# EAGLE design ESP8266Shield (EAGLE 7.1.0)
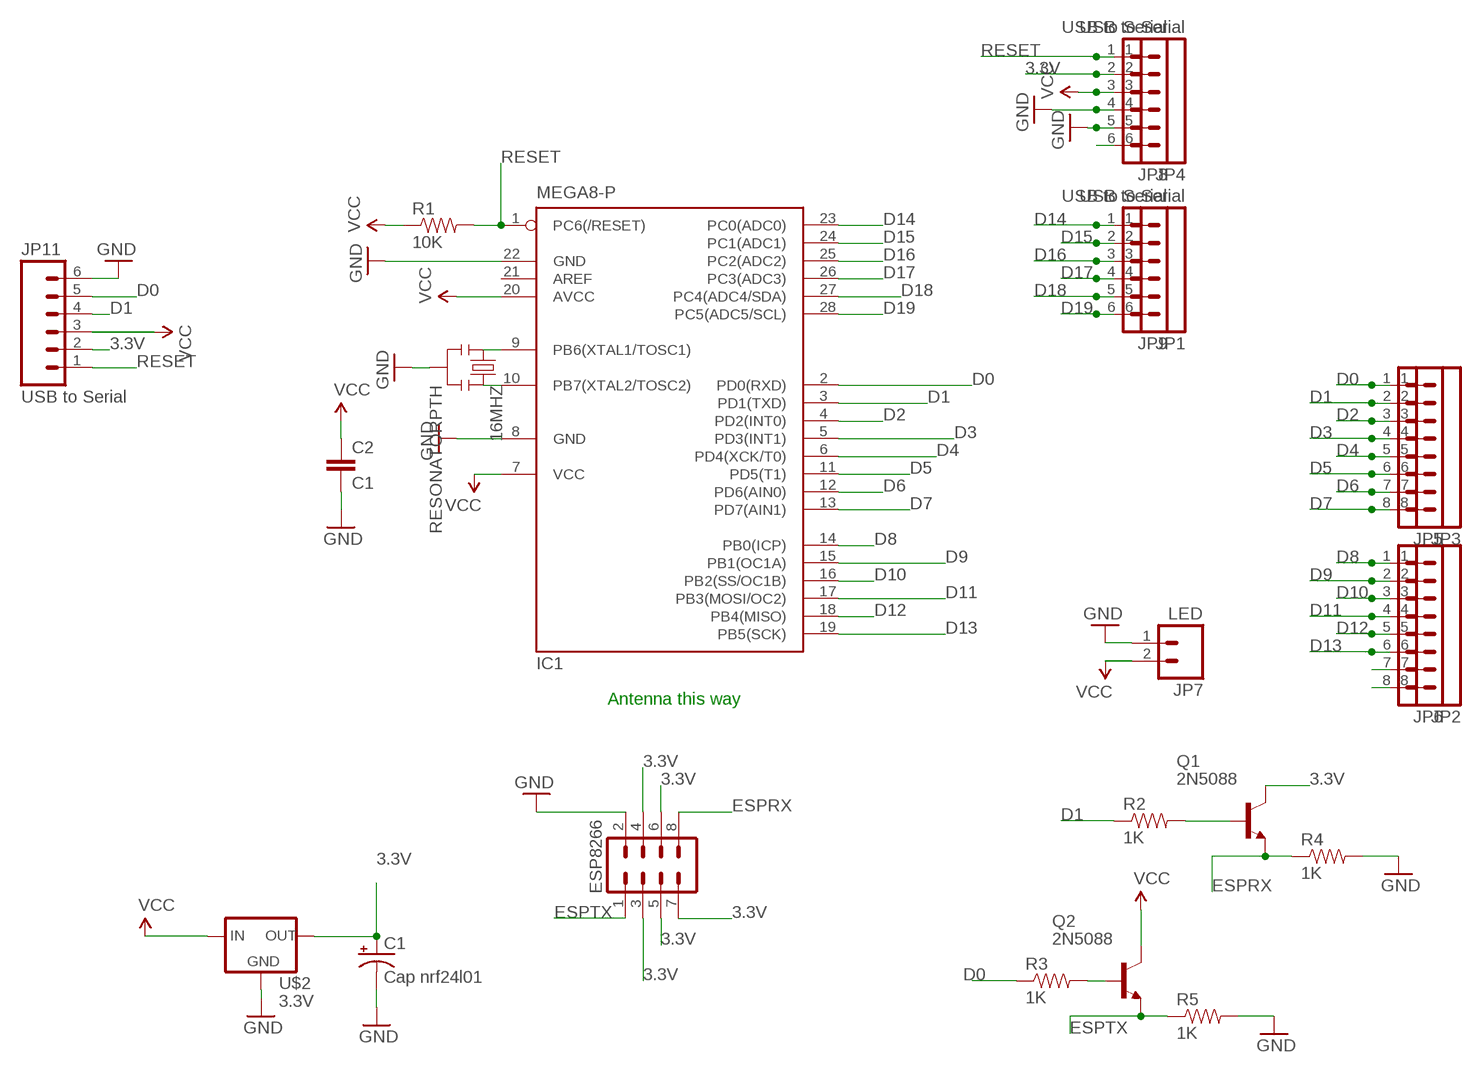
[diagram p0: schematic, sheet 1]

## Parts
16MHZ  RESONATORPTH  [RESONATOR-PTH]
C1  Cap nrf24l01  CAP_POLPTH2  [CPOL-RADIAL-10UF-25V]
C2  C1  CAPPTH  [CAP-PTH-SMALL]
ESP8266  M04X2  [2X4]
IC1  MEGA8-P  [DIL28-3]
JP1  USB to Serial  M06SIP  [1X06]
JP2  M08  [1X08]
JP3  M08  [1X08]
JP4  USB to Serial  M06SIP  [1X06]
JP5  M08  [1X08]
JP6  M08  [1X08]
JP7  LED  M02PTH  [1X02]
JP8  USB to Serial  M06SIP  [1X06]
JP9  USB to Serial  M06SIP  [1X06]
JP11  USB to Serial  M06SIP  [1X06]
Q1  2N5088  [TO92]
Q2  2N5088  [TO92]
R1  10K  RESISTORPTH1  [AXIAL-0.3]
R2  1K  RESISTORPTH1  [AXIAL-0.3]
R3  1K  RESISTORPTH1  [AXIAL-0.3]
R4  1K  RESISTORPTH1  [AXIAL-0.3]
R5  1K  RESISTORPTH1  [AXIAL-0.3]
U$2  3.3V  V_REG_LD1117VXX  [78XXL]

## Nets
3.3V: C1.1(+) ESP8266.3 ESP8266.4 ESP8266.5 ESP8266.6 ESP8266.7 JP4.2 JP8.2 JP11.2 Q1.1(C) U$2.GND(OUT)
D0: IC1.2(PD0(RXD)) JP3.1 JP5.1 JP11.5 R3.P$1
D1: IC1.3(PD1(TXD)) JP3.2 JP5.2 JP11.4 R2.P$1
D2: IC1.4(PD2(INT0)) JP3.3 JP5.3
D3: IC1.5(PD3(INT1)) JP3.4 JP5.4
D4: IC1.6(PD4(XCK/T0)) JP3.5 JP5.5
D5: IC1.11(PD5(T1)) JP3.6 JP5.6
D6: IC1.12(PD6(AIN0)) JP3.7 JP5.7
D7: IC1.13(PD7(AIN1)) JP3.8 JP5.8
D8: IC1.14(PB0(ICP)) JP2.1 JP6.1
D9: IC1.15(PB1(OC1A)) JP2.2 JP6.2
D10: IC1.16(PB2(SS/OC1B)) JP2.3 JP6.3
D11: IC1.17(PB3(MOSI/OC2)) JP2.4 JP6.4
D12: IC1.18(PB4(MISO)) JP2.5 JP6.5
D13: IC1.19(PB5(SCK)) JP2.6 JP6.6
D14: IC1.23(PC0(ADC0)) JP1.1 JP9.1
D15: IC1.24(PC1(ADC1)) JP1.2 JP9.2
D16: IC1.25(PC2(ADC2)) JP1.3 JP9.3
D17: IC1.26(PC3(ADC3)) JP1.4 JP9.4
D18: IC1.27(PC4(ADC4/SDA)) JP1.5 JP9.5
D19: IC1.28(PC5(ADC5/SCL)) JP1.6 JP9.6
ESPRX: ESP8266.8 Q1.3(E) R4.P$1
ESPTX: ESP8266.1 Q2.3(E) R5.P$1
GND: 16MHZ.2 C1.2(-) C2.2 ESP8266.2 IC1.8(GND) IC1.22(GND) JP4.4 JP4.5 JP7.1 JP8.4 JP8.5 JP11.6 R4.P$2 R5.P$2 U$2.IN(GND)
N$1: 16MHZ.3 IC1.10(PB7(XTAL2/TOSC2))
N$2: 16MHZ.1 IC1.9(PB6(XTAL1/TOSC1))
N$3: Q1.2(B) R2.P$2
N$4: Q2.2(B) R3.P$2
N$5: JP2.7 JP6.7
N$6: JP2.8 JP6.8
N$7: JP4.6 JP8.6
RESET: IC1.1(PC6(/RESET)) JP4.1 JP8.1 JP11.1 R1.P$2
VCC: C2.1 IC1.7(VCC) IC1.20(AVCC) JP4.3 JP7.2 JP8.3 JP11.3 Q2.1(C) R1.P$1 U$2.OUT(IN)
Unconnected: IC1.21(AREF)

## Notes on the sheet
- Antenna this way

## Library data of the parts
16MHZ = SparkFun:RESONATOR: Resonator Small SMD resonator. This is the itty bitty 10/20MHz resonators with built in caps. CSTCE10M0G55 and CSTCE20M0V53. Footprint has been reviewed closely but hasn't been tested yet.
C1 = SparkFun:CAP_POL: Capacitor Polarized These are standard SMD and PTH capacitors. Normally 10uF, 47uF, and 100uF in electrolytic and tantalum varieties. Always verify the external diameter of the through hole cap, it varies with capacity, voltage, and manufacturer. The EIA devices should be standard.
C2 = SparkFun:CAP: Capacitor Standard 0603 ceramic capacitor, and 0.1" leaded capacitor.
ESP8266 = SparkFun:M04X2
IC1 = atmel:MEGA8-P: MICROCONTROLLER 8 Kbytes FLASH, 1 kbytes SRAM, 512 bytes EEPROM, USART, 4-channel 10 bit ADC, 2-channel 8 bit ADC Pin compatible with Atmega48, ATMega88, ATMega168 Source: avr.lbr; OC_FARNELL: unknown; OC_NEWARK: unknown
JP1 JP4 JP8 JP9 JP11 = SparkFun:M06: Header 6 Standard 6-pin 0.1" header. Use with straight break away headers (SKU : PRT-00116), right angle break away headers (PRT-00553), swiss pins (PRT-00743), machine pins (PRT-00117), and female headers (PRT-00115). Molex polarized connector foot print use with SKU : PRT-08094 with associated crimp pins and housings. NOTES ON THE VARIANTS LOCK and LOCK_LONGPADS... This footprint was designed to help hold the alignment of a through-hole component (i.e. 6-pin header) while soldering it into place. You may notice that each hole has been shifted either up or down by 0.005 of an inch from it's more standard position (which is a perfectly straight line). This slight alteration caused the pins (the squares in the middle) to touch the edges of the holes. Because they are alternating, it causes a "brace" to hold the component in place. 0.005 has proven to be the perfect amount of "off-center" position when using our standard breakaway headers. Although looks a little odd when you look at the bare footprint, once you have a header in there, the alteration is very hard to notice. Also, if you push a header all the way into place, it is covered up entirely on the bottom side. This idea of altering the position of holes to aid alignment will be further integrated into the Sparkfun Library for other footprints. It can help hold any component with 3 or more connection pins.
JP2 JP3 JP5 JP6 = SparkFun:M08: Header 8 Standard 8-pin 0.1" header. Use with straight break away headers (SKU : PRT-00116), right angle break away headers (PRT-00553), swiss pins (PRT-00743), machine pins (PRT-00117), and female headers (PRT-00115).
JP7 = SparkFun:M02: Header 2 Standard 2-pin 0.1" header. Use with straight break away headers (SKU : PRT-00116), right angle break away headers (PRT-00553), swiss pins (PRT-00743), machine pins (PRT-00117), and female headers (PRT-00115). Molex polarized connector foot print use with SKU : PRT-08233 with associated crimp pins and housings.
Q1 Q2 = transistor-npn:2N5088: NPN Transistor
R1-R5 = SparkFun:RESISTOR: Resistor Basic schematic elements and footprints for 0603, 1206, and PTH 1/10th watt (small) resistors.
U$2 = SparkFun:V_REG_LD1117VXX: LD1117VXX voltage regulator. We carry the 3.3V version (COM-00526) in TO-220 package.

## Board
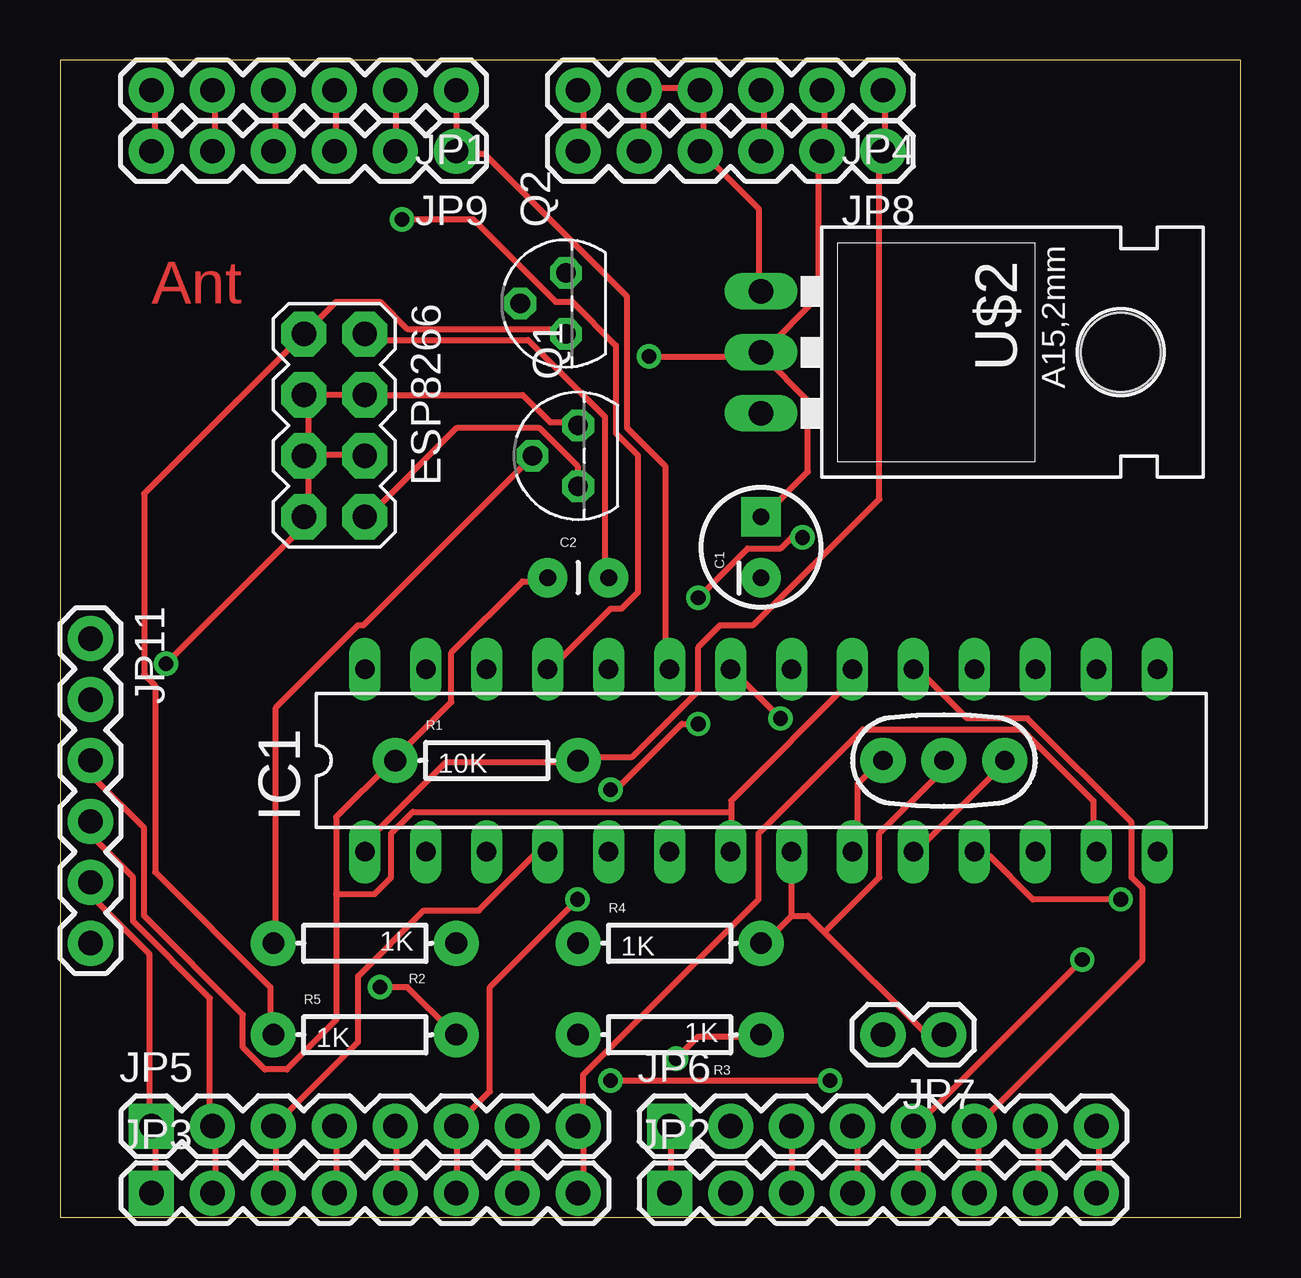
[diagram p1: board, top side]
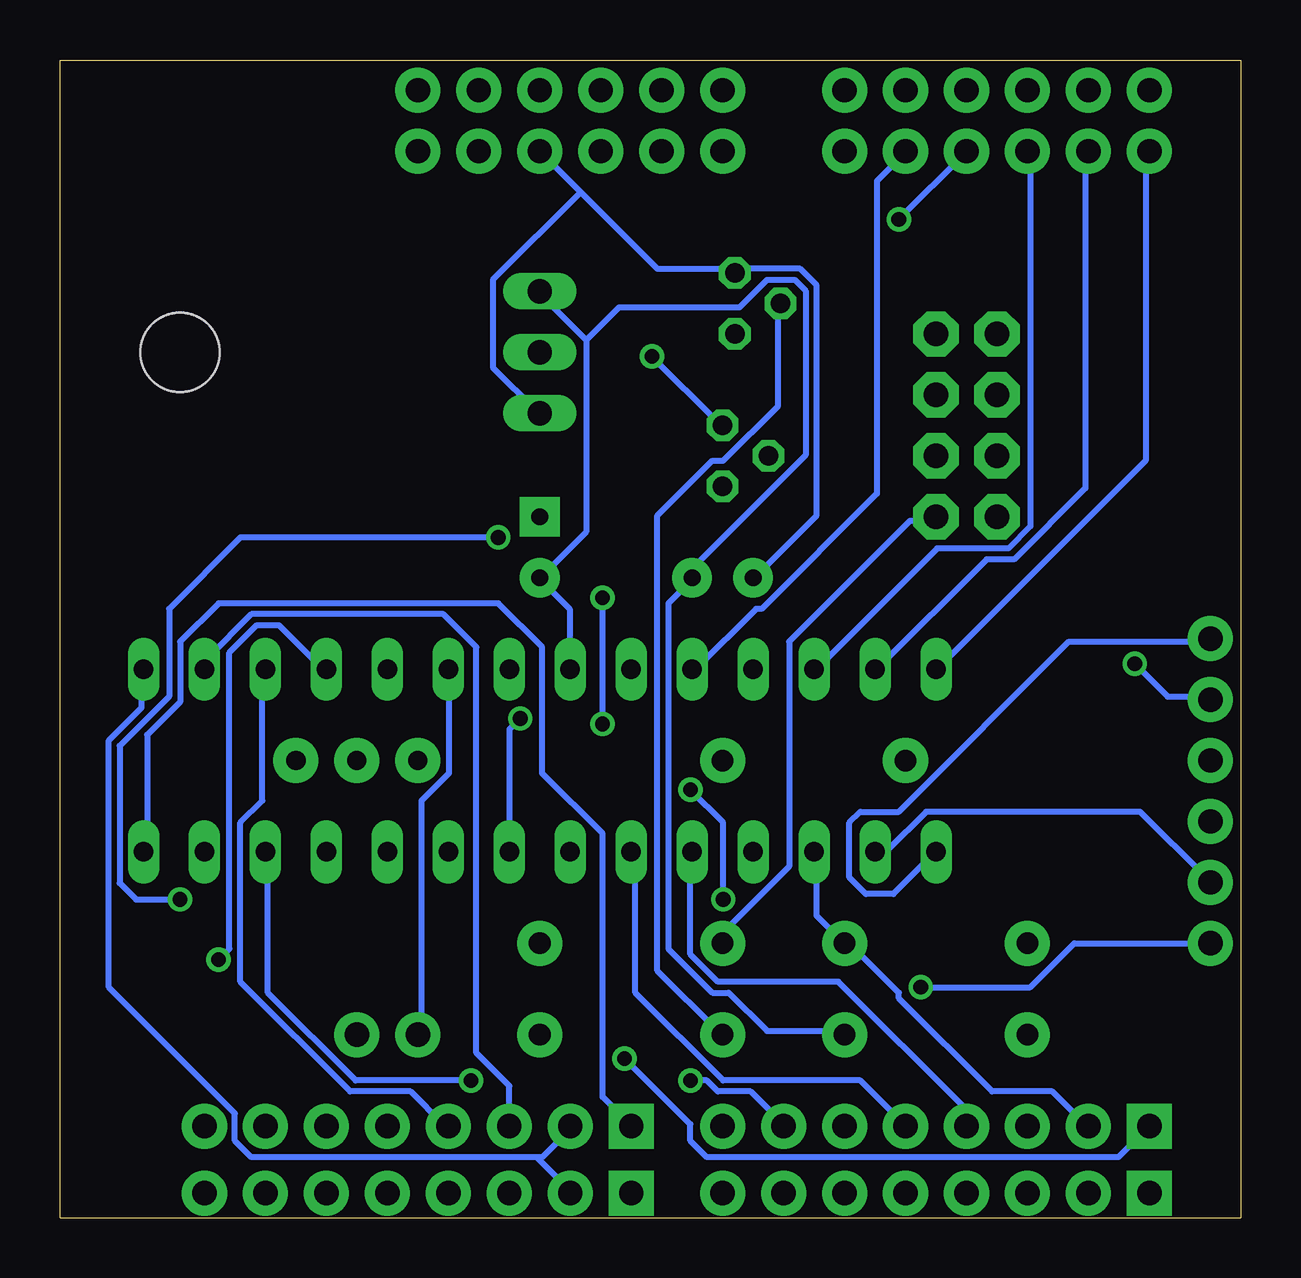
[diagram p2: board, bottom side, seen from below]

Size 49.2 x 48.26 mm. Coordinates in mm from the lower left corner, seen from the top.
Outline: 49.2,0 49.2,48.26 0,48.26 0,0 49.2,0
Copper layers (1*16): Top 0.035mm / dielectric 1.5mm / Bottom 0.035mm
Design rules "default": minimum track width 10mil, minimum drill 24mil, track to track 8mil, track to pad 8mil, pad to pad 8mil, via to via 8mil, smd to smd 8mil, copper to edge 40mil, drill to drill 8mil, minimum pad ring 10mil, minimum via ring 8mil, stop-mask expansion 4mil, vias tented up to drill 0mil, thermal gap 10mil

### Footprints (pad centres in the part's own frame; a part is rotated, then mirrored left to right if it is on the bottom)
RESONATOR-PTH = drill 0.8 pad 1.88: 1 -2.54,0; 2 0,0; 3 2.54,0
CPOL-RADIAL-10UF-25V = drill 0.7 pad 1.651 square: 1 1.27,0 | drill 0.7 pad 1.651: 2 -1.27,0
CAP-PTH-SMALL = drill 0.7 pad 1.651: 1 0,0; 2 2.54,0
2X4 = drill 1.016 pad 1.88 octagon: 1 -3.81,-1.27; 2 -3.81,1.27; 3 -1.27,-1.27; 4 -1.27,1.27; 5 1.27,-1.27; 6 1.27,1.27; 7 3.81,-1.27; 8 3.81,1.27
DIL28-3 = drill 0.813 long: 1 -16.51,-3.81; 2 -13.97,-3.81; 3 -11.43,-3.81; 4 -8.89,-3.81; 5 -6.35,-3.81; 6 -3.81,-3.81; 7 -1.27,-3.81; 8 1.27,-3.81; 9 3.81,-3.81; 10 6.35,-3.81; 11 8.89,-3.81; 12 11.43,-3.81; 13 13.97,-3.81; 14 16.51,-3.81; 15 16.51,3.81; 16 13.97,3.81; 17 11.43,3.81; 18 8.89,3.81; 19 6.35,3.81; 20 3.81,3.81; 21 1.27,3.81; 22 -1.27,3.81; 23 -3.81,3.81; 24 -6.35,3.81; 25 -8.89,3.81; 26 -11.43,3.81; 27 -13.97,3.81; 28 -16.51,3.81
1X06 = drill 1.016 pad 1.88: 1 0,0; 2 2.54,0; 3 5.08,0; 4 7.62,0; 5 10.16,0; 6 12.7,0
1X08 = drill 1.016 pad 1.88 square: 1 0,0 | drill 1.016 pad 1.88: 2 2.54,0; 3 5.08,0; 4 7.62,0; 5 10.16,0; 6 12.7,0; 7 15.24,0; 8 17.78,0
1X02 = drill 1.016 pad 1.88: 1 0,0; 2 2.54,0
TO92 = drill 0.813 octagon: 1 1.27,0; 2 0,1.905; 3 -1.27,0
AXIAL-0.3 = drill 0.9 pad 1.88: P$1 -3.81,0; P$2 3.81,0
78XXL = drill 1.016 long: GND 0,-3.81; IN -2.54,-3.81; OUT 2.54,-3.81 | hole 3.302: 0,11.176

### Placement (x,y rotation side)
16MHZ  36.83,19.06 0 top
C1  29.21,27.95 90 top
C2  20.32,26.68 0 top
ESP8266  11.43,33.03 270 top
IC1  29.21,19.06 0 top
JP1  16.51,47 180 top
JP2  25.4,1.03 0 top
JP3  3.81,1.03 0 top
JP4  34.29,47 180 top
JP5  3.81,3.82 0 top
JP6  25.4,3.82 0 top
JP7  36.83,7.63 180 top
JP8  34.29,44.46 180 top
JP9  16.51,44.46 180 top
JP11  1.27,24.14 270 top
Q1  21.59,31.76 90 top
Q2  21.08,38.11 90 top
R1  17.78,19.06 0 top
R2  12.7,11.44 180 top
R3  25.4,7.63 180 top
R4  25.4,11.44 0 top
R5  12.7,7.63 0 top
U$2  33.02,36.08 270 top

### Tracks (layer width: path | path; a pad name or v marks a point on that pad's centre or on a via)
3.3V  (via drill 0.61)
  Top 0.254: JP4.2 31.85,46.87 31.85,44.59 JP8.2 31.62,44.36 31.62,38.41 29.34,36.13 U$2.GND | U$2.GND 29.34,35.9 31.17,34.07 31.17,31.1 29.34,29.27 C1.1 | Q1.1 21.56,33.16 20.42,33.16 19.28,34.3 ESP8266.4 10.36,34.3 | 10.36,31.79 12.65,31.79 ESP8266.6 | v4.42,23.1 10.36,29.04 ESP8266.7 10.36,29.27 10.36,31.56 ESP8266.5 10.36,31.79 | 10.36,31.79 10.36,34.3 | 10.36,34.3 ESP8266.3 | v24.54,35.9 29.11,35.9 U$2.GND
  Bottom 0.254: v4.42,23.1 3.05,21.73 1.45,21.73 JP11.2 | v24.54,35.9 21.79,33.16 Q1.1
D0  (via drill 0.61)
  Top 0.254: JP3.1 3.96,1.15 3.96,3.67 JP5.1 3.73,3.9 3.73,10.98 1.45,13.27 1.45,13.96 JP11.5 | v25.68,6.64 26.59,7.55 29.11,7.55 R3.P$1
  Bottom 0.254: IC1.2 15.16,15.33 14.71,15.33 13.11,16.93 4.19,16.93 1.45,14.18 JP11.5 | v25.68,6.64 22.94,3.9 22.94,3.21 22.25,2.52 5.1,2.52 JP5.1
D1
  Top 0.254: JP3.2 6.48,1.15 6.48,3.67 JP5.2 6.25,3.9 6.25,9.15 3.05,12.35 3.05,14.18 1.45,15.78 1.45,16.47 JP11.4
  Bottom 0.254: IC1.3 17.68,15.1 17.68,12.58 16.53,11.44 R2.P$1 16.31,11.44 14.25,9.38 14.25,9.15 10.36,5.27 7.85,5.27 6.48,3.9 JP5.2
D2
  Top 0.254: IC1.4 20.19,15.1 19.74,15.1 17.45,12.81 15.16,12.81 12.42,10.07 12.42,7.33 8.99,3.9 JP5.3 8.99,3.67 8.99,1.15 JP3.3
D3
  Top 0.254: JP3.4 11.51,1.15 11.51,3.67 JP5.4
  Bottom 0.254: IC1.5 22.94,15.1 22.94,10.98 21.79,9.84 16.76,9.84 11.51,4.58 11.51,3.9 JP5.4
D4
  Top 0.254: JP3.5 14.02,1.15 14.02,3.67 JP5.5
  Bottom 0.254: IC1.6 25.22,15.1 25.22,9.38 21.56,5.72 15.85,5.72 14.02,3.9 JP5.5
D5  (via drill 0.61)
  Top 0.254: v44.2,13.27 40.54,13.27 38.71,15.1 38.25,15.1 IC1.11 | v30.94,28.36 30.48,28.36 30.02,27.9 28.65,27.9 v26.59,25.84 | v26.59,20.58 25.91,20.58 23.16,17.84 v22.94,17.84 | v21.56,13.27 17.91,9.61 17.91,5.27 16.53,3.9 JP5.6 16.53,3.67 16.53,1.15 JP3.6
  Bottom 0.254: v44.2,13.27 46.02,13.27 46.71,13.96 46.71,19.67 44.65,21.73 44.65,25.39 41.68,28.36 v30.94,28.36 | v26.59,20.58 v26.59,25.84 | v22.94,17.84 21.56,16.47 v21.56,13.27
D6  (via drill 0.61)
  Top 0.254: v22.94,5.72 v32.08,5.72 | JP5.7 JP3.7
  Bottom 0.254: v32.08,5.72 36.88,5.72 40.54,9.38 40.54,15.1 IC1.12 | v22.94,5.72 22.25,5.72 21.79,5.27 20.42,5.27 19.05,3.9 JP5.7
D7
  Top 0.254: IC1.13 43.05,15.33 43.05,17.38 40.08,20.36 33.45,20.36 29.11,16.01 29.11,13.27 21.79,5.95 21.79,3.9 JP5.8 21.79,3.67 21.79,1.15 JP3.8
D8
  Top 0.254: JP2.1 25.45,1.15 25.45,3.67 JP6.1
  Bottom 0.254: IC1.14 45.57,15.33 45.57,20.13 44.2,21.5 44.2,24.01 42.6,25.61 30.94,25.61 29.11,23.78 29.11,18.53 26.59,16.01 26.59,5.04 25.45,3.9 JP6.1
D9
  Bottom 0.254: 29.34,2.52 29.11,2.52 27.96,3.67 JP6.2 | 29.34,2.52 41.22,2.52 41.91,3.21 41.91,4.35 47.17,9.61 47.17,19.9 45.8,21.27 45.8,22.87 IC1.15 | 29.34,2.52 27.96,1.15 JP2.2
D10
  Top 0.254: JP6.3 JP2.3
  Bottom 0.254: JP6.3 30.48,5.5 31.85,6.87 31.85,23.78 33.22,25.16 41.22,25.16 43.05,23.33 43.05,22.87 IC1.16
D11
  Top 0.254: JP2.4 33.22,1.15 33.22,3.67 JP6.4
  Bottom 0.254: IC1.17 40.77,22.87 40.77,17.38 41.68,16.47 41.68,9.84 37.11,5.27 34.59,5.27 33.22,3.9 JP6.4
D12  (via drill 0.61)
  Top 0.254: v42.6,10.75 35.74,3.9 JP6.5 35.74,3.67 35.74,1.15 JP2.5
  Bottom 0.254: v42.6,10.75 42.14,11.21 42.14,23.56 41,24.7 40.08,24.7 38.25,22.87 IC1.18
D13
  Top 0.254: IC1.19 35.74,22.87 37.8,20.81 40.31,20.81 44.65,16.47 44.65,14.18 45.11,13.73 45.11,10.75 38.25,3.9 JP6.6 38.25,3.67 38.25,1.15 JP2.6
D14
  Top 0.254: IC1.23 25.22,22.87 25.22,31.33 23.62,32.93 23.62,38.41 17.68,44.36 16.53,44.36 JP9.1 16.53,44.59 16.53,46.87 JP1.1
D15
  Top 0.254: JP1.2 14.02,46.87 14.02,44.59 JP9.2
  Bottom 0.254: IC1.24 22.71,22.87 20.19,25.39 19.96,25.39 15.16,30.19 15.16,43.21 14.02,44.36 JP9.2
D16  (via drill 0.61)
  Top 0.254: v14.25,41.61 17.22,41.61 20.65,38.19 21.34,38.19 23.16,36.36 23.16,32.7 24.08,31.79 24.08,26.07 23.39,25.39 22.94,25.39 20.42,22.87 IC1.25 | JP1.3 11.51,46.87 11.51,44.59 JP9.3
  Bottom 0.254: v14.25,41.61 11.51,44.36 JP9.3
D17
  Top 0.254: JP1.4 8.99,46.87 8.99,44.59 JP9.4
  Bottom 0.254: IC1.26 17.68,22.87 12.65,27.9 9.68,27.9 8.76,28.81 8.76,44.36 JP9.4
D18
  Top 0.254: JP1.5 6.48,46.87 6.48,44.59 JP9.5
  Bottom 0.254: IC1.27 15.16,22.87 10.59,27.44 9.45,27.44 6.48,30.41 6.48,44.36 JP9.5
D19
  Top 0.254: JP1.6 3.96,46.87 3.96,44.59 JP9.6
  Bottom 0.254: IC1.28 12.65,22.87 3.96,31.56 3.96,44.36 JP9.6
ESPRX
  Top 0.254: Q1.3 21.56,30.64 21.56,31.33 19.96,32.93 16.53,32.93 12.88,29.27 ESP8266.8
  Bottom 0.254: R4.P$1 21.56,11.44 21.56,11.9 18.82,14.64 18.82,24.01 13.79,29.04 12.88,29.04 ESP8266.8
ESPTX
  Top 0.254: Q2.3 20.88,37.04 14.48,37.04 13.34,38.19 11.51,38.19 ESP8266.1 3.5,30.19 3.5,22.64 3.96,22.18 3.96,14.41 8.76,9.61 8.76,7.78 R5.P$1
GND  (via drill 0.61)
  Top 0.254: C2.2 22.71,26.76 22.71,33.39 19.51,36.59 13.11,36.59 12.88,36.81 ESP8266.2 | v13.34,9.61 14.48,9.61 16.31,7.78 R5.P$2 | 30.48,12.58 IC1.8 | 30.48,12.58 29.34,11.44 R4.P$2 | 31.85,11.9 31.17,12.58 30.48,12.58 | 31.85,11.9 35.97,7.78 36.65,7.78 JP7.1 | 31.85,11.9 34.14,14.18 34.14,16.01 36.65,18.53 36.65,18.98 16MHZ.2 | JP8.5 24.31,44.59 24.31,46.87 JP4.5 24.31,47.1 26.59,47.1 JP4.4 26.82,46.87 26.82,44.59 JP8.4 26.82,44.36 29.11,42.07 29.11,38.64 U$2.IN | v30.02,20.81 27.96,22.87 IC1.22
  Bottom 0.254: R5.P$2 16.53,7.78 19.74,7.78 21.34,9.38 22.02,9.38 23.85,11.21 23.85,25.61 22.94,26.53 C2.2 22.71,26.76 22.71,27.21 18.14,31.79 18.14,38.64 18.59,39.1 19.74,39.1 20.88,37.96 25.91,37.96 27.28,36.59 | JP11.6 6.93,11.44 8.76,9.61 v13.34,9.61 | IC1.22 27.96,22.87 27.96,25.39 29.11,26.53 C1.2 29.11,26.76 27.28,28.59 27.28,36.59 | 27.28,36.59 29.11,38.41 U$2.IN | IC1.8 30.48,20.36 v30.02,20.81
N$1
  Top 0.254: IC1.10 35.74,15.33 39.39,18.98 16MHZ.3
N$2
  Top 0.254: IC1.9 33.22,15.33 33.22,18.07 34.14,18.98 16MHZ.1
N$3
  Top 0.254: Q1.2 19.51,31.56 12.65,24.7 12.42,24.7 8.99,21.27 8.99,11.44 R2.P$2
N$4
  Bottom 0.254: Q2.2 19.28,37.96 19.28,33.84 21.56,31.56 22.02,31.56 24.31,29.27 24.31,10.3 21.79,7.78 R3.P$2
N$5
  Top 0.254: JP2.7 40.77,1.15 40.77,3.67 JP6.7
N$6
  Top 0.254: JP2.8 43.28,1.15 43.28,3.67 JP6.8
N$7
  Top 0.254: JP8.6 21.79,44.59 21.79,46.87 JP4.6
RESET
  Top 0.254: JP4.1 34.37,46.87 34.37,44.59 JP8.1 34.14,44.36 34.14,29.96 28.88,24.7 27.51,24.7 26.59,23.78 26.59,21.96 23.85,19.21 21.79,19.21 R1.P$2 21.56,18.98 16.08,18.98 12.88,15.78 12.88,15.33 IC1.1
  Bottom 0.254: JP11.1 1.45,24.01 7.16,24.01 14.25,16.93 15.85,16.93 16.31,16.47 16.31,14.18 15.62,13.5 14.48,13.5 12.88,15.1 IC1.1
VCC
  Top 0.254: JP4.3 29.34,46.87 29.34,44.59 JP8.3 | 27.96,16.93 27.96,17.38 32.99,22.41 32.99,22.87 IC1.20 | 27.96,16.93 27.96,15.33 IC1.7 | C2.1 20.19,26.53 19.28,26.53 16.31,23.56 16.31,21.5 14.02,19.21 R1.P$1 13.79,18.98 11.51,16.7 11.51,13.5 | 11.51,13.5 11.51,8.24 9.45,6.18 8.53,6.18 7.62,7.1 7.62,8.47 3.5,12.58 3.5,16.24 1.45,18.3 1.45,18.98 JP11.3 | 27.96,16.93 14.71,16.93 13.79,16.01 13.79,14.18 13.11,13.5 11.51,13.5
  Bottom 0.254: JP8.3 27.51,42.76 | 27.51,42.76 24.31,39.56 21.11,39.56 Q2.1 20.88,39.56 18.36,39.56 17.68,38.87 17.68,29.27 20.19,26.76 C2.1 | 27.51,42.76 31.17,39.1 31.17,35.44 29.34,33.61 U$2.OUT | JP7.2 34.14,7.78 34.14,17.38 32.99,18.53 32.99,22.87 IC1.20

### Text on the board
Top: Ant